# Altium schematic sheet MCU.SchDoc
size A4; SheetNumber: 4; SheetTotal: 4
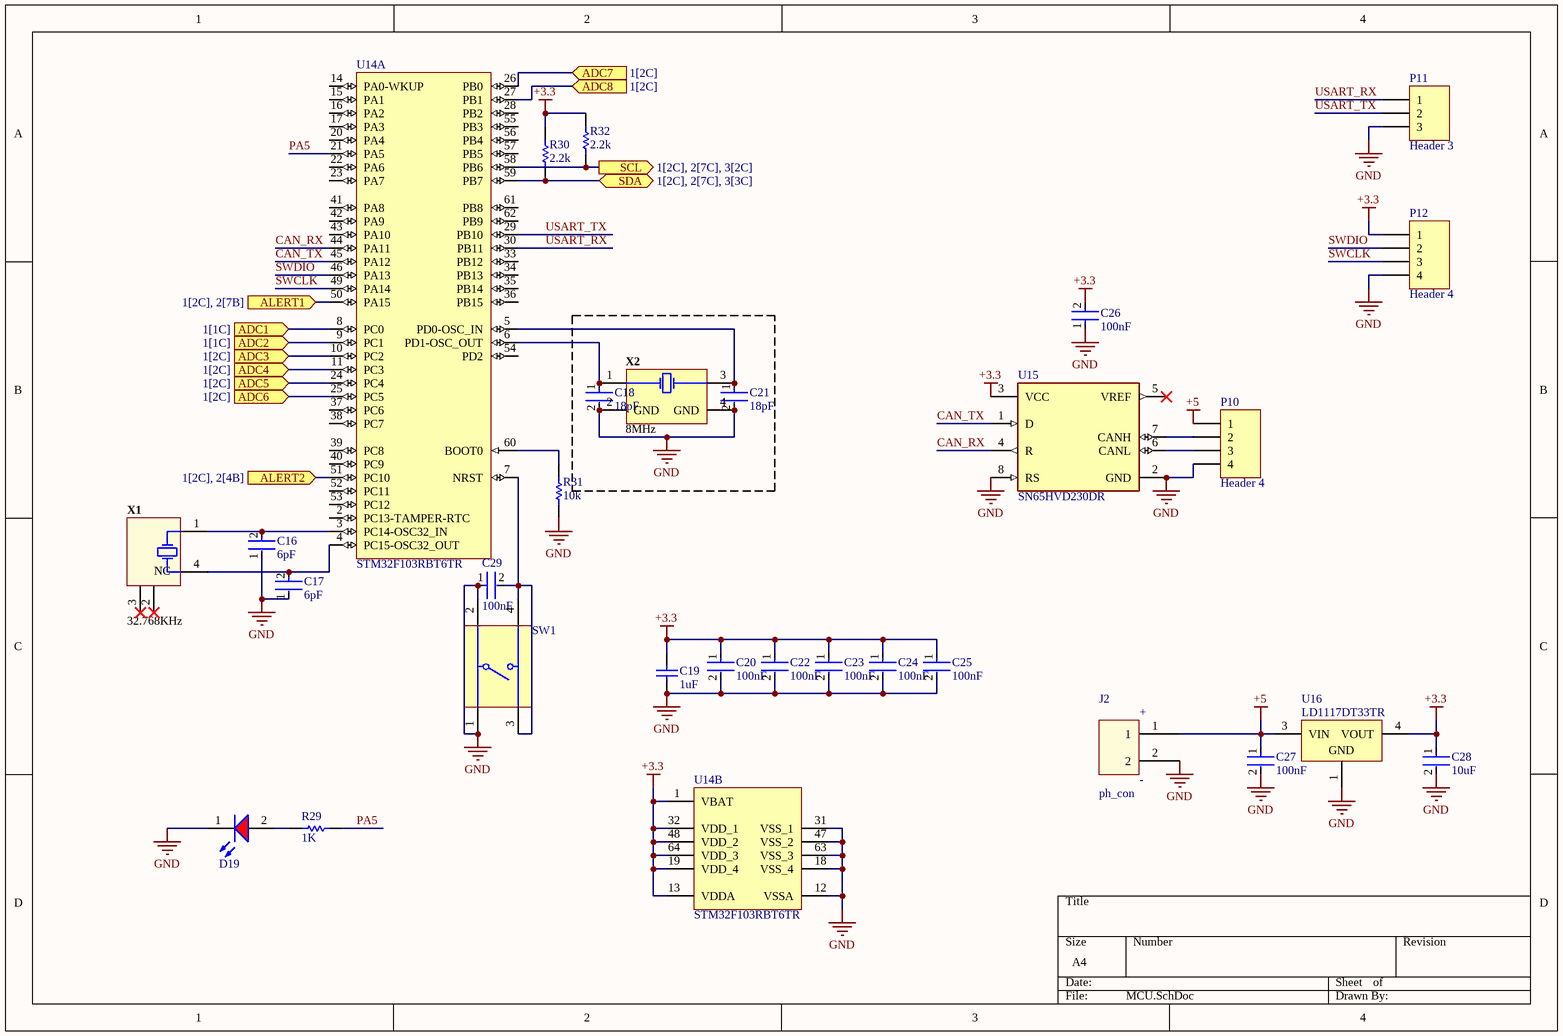
[diagram p0: MCU.SchDoc]

## Parts
C16  6pF  [FP-C1608-080-0_1-IPC_C]
C17  6pF  [FP-C1608-080-0_1-IPC_C]
C18  18pF  [FP-C0603C-CF-MFG]
C19  1uF  [CAPC2013X145X50LL20T25]
C20  100nF  [FP-0805-L_2_01_0_2-W_1_25-IPC_B]
C21  18pF  [FP-C0603C-CF-MFG]
C22  100nF  [FP-0805-L_2_01_0_2-W_1_25-IPC_B]
C23  100nF  [FP-0805-L_2_01_0_2-W_1_25-IPC_B]
C24  100nF  [FP-0805-L_2_01_0_2-W_1_25-IPC_B]
C25  100nF  [FP-0805-L_2_01_0_2-W_1_25-IPC_B]
C26  100nF  [FP-0805-L_2_01_0_2-W_1_25-IPC_B]
C27  100nF  [FP-0805-L_2_01_0_2-W_1_25-IPC_B]
C28  10uF  [FP-C0805C-DG-IPC_B]
C29  100nF  [FP-0805-L_2_01_0_2-W_1_25-IPC_B]
D19  150080SS75000  [WL-SMCW_0805_150080xx75000]  (value not drawn)
J2  ph_con  [Phoenix]
P10  Header 4  [HDR1X4]
P11  Header 3  [HDR1X3]
P12  Header 4  [HDR1X4]
R29  1K  [RESC2013X60X35ML10T20]
R30  2.2k  [RESC2013X60X35ML10T20]
R31  10k  [RESC2013X60X35ML10T20]
R32  2.2k  [RESC2013X60X35ML10T20]
SW1  PTS525SM10SMTRLFS  [CKCP-PTS525SM10SMTR-4_V]  (value not drawn)
U14  STM32F103RBT6TR  [STM-LQFP64_V]  (parts A,B of 2)
U15  SN65HVD230DR  [FP-D0008A-IPC_A]
U16  LD1117DT33TR  [TO-252_M]
X1  32.768KHz  [ABRA-ABS25-4_V]
X2  8MHz  [TXC-7B-4_V]

## Ports
ADC1 (in, see 1[1C]), ADC2 (in, see 1[1C]), ADC3 (in, see 1[2C]), ADC4 (in, see 1[2C]), ADC5 (in, see 1[2C]), ADC6 (in, see 1[2C]), ADC7 (in, see 1[2C]), ADC8 (in, see 1[2C]), ALERT1 (in, see 1[2C], 2[7B]), ALERT2 (in, see 1[2C], 2[4B]), SCL (out, see 1[2C], 2[7C], 3[2C]), SDA (bidir, see 1[2C], 2[7C], 3[3C])

## Nets
+3.3: C19.2 C20.1 C22.1 C23.1 C24.1 C25.1 C26.2 C28.1 P12.1 R30.2 R32.2 U14.1(VBAT) U14.13(VDDA) U14.19(VDD_4) U14.32(VDD_1) U14.48(VDD_2) U14.64(VDD_3) U15.3(VCC) U16.4(VOUT)
+5: C27.1 J2.1 P10.1 U16.3(VIN)
GND: C16.1 C17.1 C18.2 C19.1 C20.2 C21.2 C22.2 C23.2 C24.2 C25.2 C26.1 C27.2 C28.2 C29.1 D19.1(K) J2.2 P10.4 P11.3 P12.4 R31.1 SW1.1 SW1.2 U14.12(VSSA) U14.18(VSS_4) U14.31(VSS_1) U14.47(VSS_2) U14.63(VSS_3) U15.2(GND) U15.8(RS) U16.1(GND) X2.2(GND) X2.4(GND)
ADC1: U14.8(PC0) ; port ADC1
ADC2: U14.9(PC1) ; port ADC2
ADC3: U14.10(PC2) ; port ADC3
ADC4: U14.11(PC3) ; port ADC4
ADC5: U14.24(PC4) ; port ADC5
ADC6: U14.25(PC5) ; port ADC6
ADC7: U14.26(PB0) ; port ADC7
ADC8: U14.27(PB1) ; port ADC8
ALERT1: U14.50(PA15) ; port ALERT1
ALERT2: U14.51(PC10) ; port ALERT2
CAN_RX: U14.44(PA11) U15.4(R)
CAN_TX: U14.45(PA12) U15.1(D)
PA5: R29.1 U14.21(PA5)
SCL: R32.1 U14.58(PB6) ; port SCL
SDA: R30.1 U14.59(PB7) ; port SDA
SWCLK: P12.3 U14.49(PA14)
SWDIO: P12.2 U14.46(PA13)
USART_RX: P11.1 U14.30(PB11)
USART_TX: P11.2 U14.29(PB10)
NetC16_2: C16.2 U14.3(PC14-OSC32_IN) X1.1(X1)
NetC17_2: C17.2 U14.4(PC15-OSC32_OUT) X1.4(X2)
NetC18_1: C18.1 U14.6(PD1-OSC_OUT) X2.1(X1)
NetC21_1: C21.1 U14.5(PD0-OSC_IN) X2.3(X2)
NetC29_2: C29.2 SW1.3 SW1.4 U14.7(NRST)
NetD19_2: D19.2(A) R29.2
NetP10_2: P10.2 U15.7(CANH)
NetP10_3: P10.3 U15.6(CANL)
NetR31_2: R31.2 U14.60(BOOT0)

Not connected (* = marked no-connect by the designer): U14 2(PC13-TAMPER-RTC) 14(PA0-WKUP) 15(PA1) 16(PA2) 17(PA3) 20(PA4) 22(PA6) 23(PA7) 28(PB2) 33(PB12) 34(PB13) 35(PB14) 36(PB15) 37(PC6) 38(PC7) 39(PC8) 40(PC9) 41(PA8) 42(PA9) 43(PA10) 52(PC11) 53(PC12) 54(PD2) 55(PB3) 56(PB4) 57(PB5) 61(PB8) 62(PB9); U15 5(VREF)*; X1 2(NC)* 3(NC)*

## Notes on the sheet
- (in symbol Connector_2) +; -

## Library data of the parts
C16 C17 = CMP-08246-006295-1: Multilayer Ceramic Capacitors 6pF ±0.25pF 50V C0G SMD 0603; Case Code (Imperial): 0603; Voltage Rating: 50V; Height: 0.8mm; RoHS Compliant: Yes; Voltage Rating (DC): 50V; Dielectric: C0G; Capacitance: 6pF; Termination: SMD/SMT; Case/Package: 0603; Mount: Surface Mount; Dielectric Material: Ceramic; Thickness: 0.037inch; Packaging: Tape and Reel; Max Operating Temperature: 125°C; Min Operating Temperature: -55°C; Weight: 7.1E-05oz; REACH SVHC: No SVHC; Width: 0.031inch; Case Code (Metric): 1608; Construction: Flat; Series: C; Depth: 0.8mm; Package Quantity: 4000; Lead Free: Lead Free; Length: 1.6mm
C18 C21 = CMP-2006-03103-2: CAP CER 18PF 100V 5% NP0 0603; Manufacturer: KEMET; Manufacturer Part Number: C0603C180J1GACTU; Automotive Grade: Grade 1; Temperature Characteristic: C0G; Material: Ceramic; Tolerance: 0.05; Temperature Coefficient: 30ppm/°C; Temperature Range High: +125°C; RoHS: TRUE; Lead Free: Yes; Device Class L1: Passive Components; Mouser Description: Multilayer Ceramic Capacitors MLCC - SMD/SMT 100volts 18pF C0G 5%; Automotive: Yes; Category: Cap; Temperature Range Low: -55°C; Package: C0603C-CF; Digikey Description: CAP CER 18PF 100V 5% NP0 0603; Voltage Rating: 100 V; Value: 18 pF; Device Class L3: Ceramic Capacitors; Temperature: -55°C to +125°C; Capacitance: 18 pF; Octopart: https://octopart.com/c0603c180j1gactu-kemet-9138579; Height: 0.87mm; ComponentLink2URL: https://api.kemet.com/component-edge/download/datasheet/C0603C100J5GACAUTO.pdf; ComponentLink2Description: Datasheet; Device Class L2: Capacitors
C19 = CMP-1036-04746-2: Manufacturer: Kemet; Part Number: C0805C105K4PACTU
C20 C22-C27 C29 = CMP-2007-04174-2: General Purpose Ceramic Capacitor, 0805, 100nF, 10%, X7R, 15%, 100V; Packaging: Tape and Reel; Min Operating Temperature: -55°C; Dielectric Material: Ceramic; Height: 1.4mm; Voltage Rating: 100V; Termination: SMD/SMT; Case Code (Imperial): 0805; Case Code (Metric): 2012; Case/Package: 0805; Construction: Flat; Radiation Hardening: No; Series: -; Dielectric: X7R; Package Quantity: 2000; Mount: Surface Mount; Capacitance: 100nF; Contact Plating: Tin; Voltage: 100V; Lead Free: Lead Free; Depth: 1.25mm; RoHS Compliant: Yes; Number of Pins: 2; Max Operating Temperature: 125°C; Length: 2.01mm; Voltage Rating (DC): 100V; Thickness: 0.055inch; REACH SVHC: No SVHC; Width: 0.049inch; Tolerance: 10%
C28 = CMP-2007-03243-2: CAP CER 10UF 10V X5R 0805; Manufacturer Part Number: C0805C106K8PACTU; Manufacturer: Kemet; 3DS Part Number: 220-00001; Tolerance: 10%; Temperature Coefficient: 15%; Material: Ceramic; Device Class L2: Capacitors; Device Class L1: Passive Components; ComponentLink2URL: https://content.kemet.com/datasheets/KEM_C1006_X5R_SMD.pdf; Height: 1.4mm; Lead Free: Yes; Digikey Description: CAP CER 10UF 10V X5R 0805; Octopart: https://octopart.com/c0805c106k8pactu-kemet-98697; Capacitance: 10uF; Value: 10uF; Temperature Range Low: -55°C; Temperature: -55°C to +85°C; Automotive: No; Mouser Description: CAP CER 10UF 10V X5R 0805; Ipc Land Pattern Name: CAPC200125X125; Temperature Range High: +85°C; Voltage: 10V; RoHS: TRUE; Device Class L3: Ceramic Capacitors; ComponentLink2Description: Datasheet; Voltage Rating: 10V; Package: C0805C-DG; Temperature Characteristic: X5R; Category: Cap
D19 = CMP-1426-00010-3: NexarPartId: 29717782; Peak Wavelength: 645nm; Luminous Intensity: 60mcd; Max Junction Temperature (Tj): 95°C; Wavelength: 630nm; Forward Current: 100mA; Max Reverse Voltage (DC): 5V; Color: Red; Lens Style: Clear, Rectangular; Test Current: 20mA; Power Dissipation: 72mW; Viewing Angle: 140°; Forward Voltage: 1.9V; Case Code (Metric): 2012; Max Operating Temperature: 85°C; Mount: Surface Mount; Height: 700µm; Case/Package: 0805; Min Operating Temperature: -40°C; Reverse Voltage: 5V; RoHS: Compliant; Packaging: Tape and Reel; REACH SVHC: Unknown; Case Code (Imperial): 0805; Length: 2mm; Width: 1.25mm; Dominant Wavelength: 630nm
J2 = Connector_2
P10 P12 = Header 4: Header, 4-Pin; LatestRevisionDate: 17-Jul-2002; LatestRevisionNote: Re-released for DXP Platform.; Publisher: Altium Limited
P11 = Header 3: Header, 3-Pin; LatestRevisionDate: 17-Jul-2002; LatestRevisionNote: Re-released for DXP Platform.; Publisher: Altium Limited
R29 = CMP-2100-03671-1: Chip Resistor, 1 KOhm, +/- 1%, 125 mW, -55 to 155 degC, 0805 (2012 Metric), RoHS, Tape and Reel; Manufacturer: Yageo; Temperature Coefficient: 100ppm/degreesC; Voltage Rating (DC): 150V; Max Power Dissipation: 125mW; Resistance: 1KOhm; Number of Pins: 2; Number of Terminations: 2; Datasheet URL: http://www.yageo.com/NewPortal/yageodocoutput?fileName=/pdf/R-Chip/PYu-RC_Group_51_RoHS_L_5.pdf; Length: 0.079inch; Package Description: 2-Pin Surface Mounted Device, Body 2 x 1.25 mm; Depth: 1.25mm; Height: 0.024inch; Military Standard: Not; Case/Package: 0805; Package Reference: 0805; RoHSCompliant: true; Lead Free: LeadFree; Packaging: TapeandReel; Package Quantity: 1; Datasheet Version: Rev. 5, 10/2016; Tolerance: 1%; Min Operating Temperature: -55degC; Voltage Rating: 150V; Composition: ThickFilm; Case Code (Imperial): 0805; Power Rating: 125mW; Width: 0.049inch; Case Code (Metric): 2012; Manufacturer URL: http://www.yageo.com/; Max Operating Temperature: 155degC; REACH SVHC: Unknown; Termination: SMD/SMT
R30-R32 = CMP-2100-03673-1: Chip Resistor, 0 Ohm, Jumper, +/- 5%, 0.125 W, -55 to 155 degC, 0805 (2012 Metric), RoHS, Tape and Reel; Manufacturer: Yageo; Power Rating: 125mW; Resistance: 0mOhm; Voltage Rating (DC): 150V; Temperature Coefficient: 200ppm/degreesC; Height: 0.5mm; Depth: 1.25mm; Case Code (Imperial): 0805; Lead Free: LeadFree; Military Standard: Not; Package Description: 2-Pin Surface Mounted Device, Body 2 x 1.25 mm; Case Code (Metric): 2012; Composition: ThickFilm; Voltage Rating: 150V; Manufacturer URL: http://www.yageo.com/; Packaging: TapeandReel; Package Reference: 0805; REACH SVHC: Unknown; Tolerance: 5%; Case/Package: 0805; Max Operating Temperature: 155degC; Number of Pins: 2; Min Operating Temperature: -55degC; RoHSCompliant: true; Length: 2mm; Datasheet URL: http://www.yageo.com/NewPortal/yageodocoutput?fileName=/pdf/R-Chip/PYu-RC_Group_51_RoHS_L_5.pdf; Termination: SMD/SMT; Radiation Hardening: No; Width: 1.25mm; Contact Plating: Tin; Datasheet Version: Rev. 5, 10/2016
SW1 = CMP-2000-05088-1: Microminiature Tact Switch, SPST-NO, 50 mA, 12 VDC, -40 to 60 degC, 4-Pin SMD, RoHS, Tape and Reel; Manufacturer: C&K Components; Maximum DC Voltage Rating: 12V; Body Orientation: Straight; Dielectric Strength: 250VAC; Pole Throw Configuration: SPST; Operating Force: 1.57N; Minimum Insulation Resistance: 100000MOhm; Actuator Length: 0.3mm; Base Material: Nylon6/6,Glass/Polyester; Switch Configuration: N.O.; Contact Rating @ Voltage: 0.05@12VDCA; Ground Terminal: No; Mechanical Life: 100000Cycles; Actuator Style: RoundButton; Illumination Type: N/R; Maximum Contact Resistance: 100mOhm; Datasheet Version: Apr-09; Contact Material: PhosphorBronze; Dimension: 5.25x6.4x1.5mm; Family: PTS525; Type: N/A; Seal Description: N/A; Mounting: SurfaceMount,GullWing; Product Weight: N/A; Seal Location: N/A; Electrical Life: N/A; Manufacturer URL: http://www.ckswitches.com/; Part No: PTS525SM10SMTRLFS; Datasheet URL: https://datasheet.ciiva.com/18145/getdatasheetpartid-226915-18145102.pdf; Maximum AC Voltage Rating: N/A; Supplier: C&KComponents; HTS: 8536501199; Contact Plating: SilverClad; Actuator Color: N/A; Operating Temperature: -40to60C; ECCN: EAR99; Supplier Standard Pack: 3,000; RoHS: Yes; Housing Material: N/A; Packaging: TapeandReel
U14 = CMP-0237-00169-4: ARM Cortex-M3 32-bit MCU, 128 KB Flash, 20 KB Internal RAM, 51 I/Os, 64-pin LQFP, -40 to 85 degC, Tape and Reel; Operating Frequency(F) (Processor speed) (MHz): 72; Internal RAM Size (kB): 20; I/Os (High Current): 51; FLASH Size (Prog) (kB): 128; Supply Voltage(Vcc) min (V): 2; A/D Converter: 2x12-bit (16 Channel); ComponentLink3URL: http://www.st.com/st-web-ui/static/active/en/resource/technical/document/datasheet/DM00037051.pdf; ComponentLink2Description: Datasheet; PackageDescription: 64-Pin Low Profile Quad Flat Package, 10 x 10 mm Body, 0.5 mm Pitch; ComponentLink3Description: Package Specification; Mounting Technology: Surface Mount; ComponentLink1Description: Manufacturer URL; DatasheetVersion: Rev. 16; PackageReference: LQFP64; PartNumber: STM32F103RBT6TR; Core: ARM Cortex-M3; ComponentLink2URL: http://www.st.com/st-web-ui/static/active/en/resource/technical/document/datasheet/CD00161566.pdf; ComponentLink1URL: http://www.st.com/web/en/home.html; PackageVersion: Rev. 4, 06/2013; Packing: Tape and Reel
U15 = CMP-0315-00015-3: IC TRANSCEIVER HALF 1/1 8SOIC; Number of Transceivers: 1; Operating Supply Voltage: 3.3V; Number of I/Os: 2; Max Supply Current: 17mA; Max Supply Voltage: 3.6V; Min Supply Voltage: 3V; Data Rate: 1Mbps; Min Operating Temperature: -40°C; Packaging: Tape and Reel; Lead Free: Lead Free; Number of Transmit Buffers: 1; Max Operating Temperature: 85°C; Number of Receive Buffers: 1; Number of Pins: 8; Package Quantity: 1; Radiation Hardening: No; Case/Package: D; REACH SVHC: No SVHC; Weight: 0.002561oz; Termination: SMD/SMT; Contact Plating: Gold; Nominal Supply Current: 17mA; Number of Receivers: 1; Number of Drivers: 1
U16 = CMP-0244-00088-1: Fixed Low Drop Positive Voltage Regulator, 3.3V, 3-Pin DPAK, Tape and Reel; ComponentLink1Description: Manufacturer URL; PackageVersion: 2011; PackageReference: TO-252; ComponentLink2Description: Datasheet; ComponentLink1URL: http://www.st.com; DatasheetVersion: 1/11/2011; PackageDescription: 3-Pin Transistor Outline Package 2.28 mm Pitch, 9.7 mm Lead Span (DPAK); ComponentLink2URL: http://www.st.com/internet/com/TECHNICAL_RESOURCES/TECHNICAL_LITERATURE/DATASHEET/CD00000544.pdf
X1 = CMP-2000-05036-1: Low Frequency Crystal, 32.768 KHz, 6 pF, +/- 20 ppm, -40 to 85 degC, 4-Pin SMD, RoHS, Tape and Reel; Manufacturer: Abracon; Tolerance: 20PPM; ESR: 50kOhms; Case Width: 3.8mm; Case Height: 2.5mm; Case Length: 8mm; Load Capacitance: 6pF; Operating Temperature Range: -40Cto+85C; Package Reference: ABS25; Factory Pack Quantity: 3000; Package Description: 4-Pin Surface Mount Device, Body 8 x 3.8 mm, Pitch 5.5 mm; Frequency: 32.768kHz; Termination Style: SMD/SMT; Manufacturer URL: http://www.abracon.com/; Type: LowFrequencyCrystal; Dimensions: 3.8mmWx8mmLx2.5mmH; Product Category: Crystals; Series: ABS25; RoHS: Details; Package / Case: 8mmx3.8mm; Datasheet Version: Jun-17; Brand: ABRACON; Datasheet URL: https://datasheet.ciiva.com/854/abs25-854528.pdf; Packaging: Reel; Mounting Style: SMD/SMT
X2 = CMP-1774-00004-1: SMD Seam Sealing Crystal, 8 MHz, +/- 30 ppm, 18 pF, -10 to 70 degC, 4-Pin SMD, RoHS, Tape and Reel; Power Rating: 100 mW; Case\Package: 0603; Voltage Rating: 50 V; Tolerance: 1%; Resistance: 150 Ohm; Package Quantity: 5000; Case Code (Metric): 1608; Packaging: Tape and Reel; Length: 1.6 mm; RoHSCompliant: true; REACH SVHC: No SVHC; Mount: Surface Mount; Case Code (Imperial): 0603; Pins: 2; Width: 0.8 mm; PackageDescription: 4-Pin Surface Mount Device, Body 5 x 3.2 mm, Pitch 3.7 mm; ComponentLink1Description: Datasheet; DatasheetVersion: Jul-15; ComponentLink1URL: http://www.txccorp.com/download/products/quartz_crystals/2015TXC_7B_19.pdf; PackageReference: 7B-4; Height: 0.45 mm; Max Operating Temperature: 155 degC; Min Operating Temperature: -55 degC; Voltage Rating (DC): 50 V